# EAGLE schematic Device_Measurement_V1.3 (EAGLE 6.5.0)
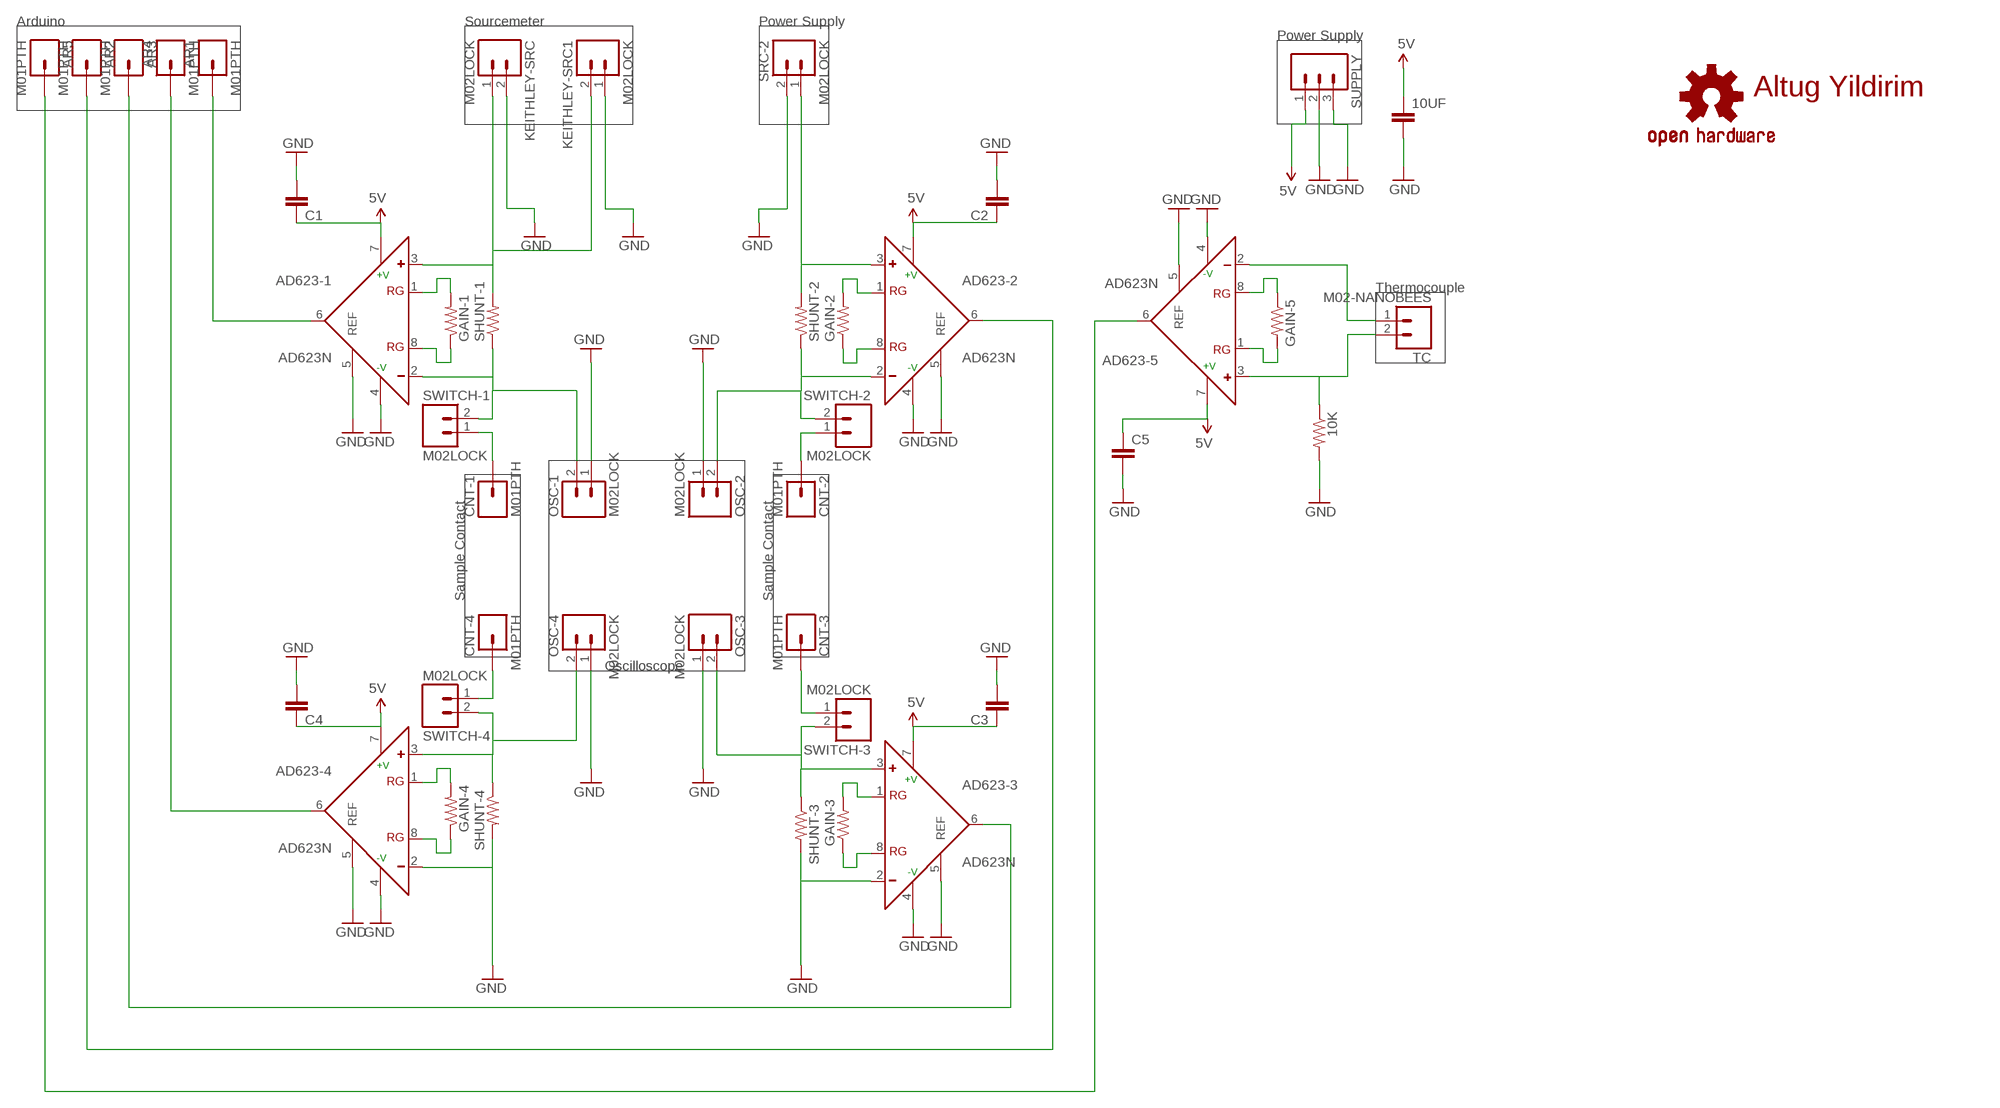
[diagram p0: schematic, sheet 1]

## Parts
10K  R-US_0207/10  [0207/10]
10UF  CAPPTH1  [CAP-PTH-5MM]
AD623-1  AD623N  [DIL08]
AD623-2  AD623N  [DIL08]
AD623-3  AD623N  [DIL08]
AD623-4  AD623N  [DIL08]
AD623-5  AD623N  [DIL08]
AR1  M01PTH  [1X01]
AR2  M01PTH  [1X01]
AR3  M01PTH  [1X01]
AR4  M01PTH  [1X01]
AR5  M01PTH  [1X01]
C1  CAPPTH1  [CAP-PTH-5MM]
C2  CAPPTH1  [CAP-PTH-5MM]
C3  CAPPTH1  [CAP-PTH-5MM]
C4  CAPPTH1  [CAP-PTH-5MM]
C5  CAPPTH1  [CAP-PTH-5MM]
CNT-1  M01PTH  [1X01]
CNT-2  M01PTH  [1X01]
CNT-3  M01PTH  [1X01]
CNT-4  M01PTH  [1X01]
GAIN-1  R-US_0207/10  [0207/10]
GAIN-2  R-US_0207/10  [0207/10]
GAIN-3  R-US_0207/10  [0207/10]
GAIN-4  R-US_0207/10  [0207/10]
GAIN-5  R-US_0207/10  [0207/10]
KEITHLEY-SRC  M02LOCK  [1X02_LOCK]
KEITHLEY-SRC1  M02LOCK  [1X02_LOCK]
LOGO1  OSHW-LOGOM  [OSHW-LOGO-M]
OSC-1  M02LOCK  [1X02_LOCK]
OSC-2  M02LOCK  [1X02_LOCK]
OSC-3  M02LOCK  [1X02_LOCK]
OSC-4  M02LOCK  [1X02_LOCK]
SHUNT-1  RESISTOR1206  [1206]
SHUNT-2  RESISTOR1206  [1206]
SHUNT-3  RESISTOR1206  [1206]
SHUNT-4  RESISTOR1206  [1206]
SRC-2  M02LOCK  [1X02_LOCK]
SUPPLY  M03PTH  [1X03]
SWITCH-1  M02LOCK  [1X02_LOCK]
SWITCH-2  M02LOCK  [1X02_LOCK]
SWITCH-3  M02LOCK  [1X02_LOCK]
SWITCH-4  M02LOCK  [1X02_LOCK]
TC  M02-NANOBEES  [M02-NANOBEES]

## Nets
5V: 10UF.1 AD623-1.7(+V) AD623-2.7(+V) AD623-3.7(+V) AD623-4.7(+V) AD623-5.7(+V) C1.1 C2.1 C3.1 C4.1 C5.1 SUPPLY.1
GND: 10K.2 10UF.2 AD623-1.4(-V) AD623-1.5(REF) AD623-2.4(-V) AD623-2.5(REF) AD623-3.2(-) AD623-3.4(-V) AD623-3.5(REF) AD623-4.2(-) AD623-4.4(-V) AD623-4.5(REF) AD623-5.4(-V) AD623-5.5(REF) C1.2 C2.2 C3.2 C4.2 C5.2 KEITHLEY-SRC1.1 KEITHLEY-SRC.2 OSC-1.1 OSC-2.1 OSC-3.1 OSC-4.1 SHUNT-3.2 SHUNT-4.2 SRC-2.2 SUPPLY.2 SUPPLY.3
N$1: AD623-1.6(OUT) AR1.1
N$2: CNT-1.1 SWITCH-1.1
N$3: AD623-2.6(OUT) AR2.1
N$4: AD623-1.1(RG) GAIN-1.2
N$5: AD623-4.6(OUT) AR4.1
N$6: AD623-1.8(RG) GAIN-1.1
N$7: AD623-3.6(OUT) AR3.1
N$8: AD623-2.2(-) OSC-2.2 SHUNT-2.1 SWITCH-2.2
N$9: AD623-5.6(OUT) AR5.1
N$10: AD623-4.3(+) OSC-4.2 SHUNT-4.1 SWITCH-4.2
N$11: AD623-2.3(+) SHUNT-2.2 SRC-2.1
N$12: CNT-2.1 SWITCH-2.1
N$13: AD623-2.1(RG) GAIN-2.2
N$14: AD623-2.8(RG) GAIN-2.1
N$15: AD623-3.3(+) OSC-3.2 SHUNT-3.1 SWITCH-3.2
N$17: 10K.1 AD623-5.3(+) TC.2
N$18: CNT-4.1 SWITCH-4.1
N$19: CNT-3.1 SWITCH-3.1
N$20: AD623-3.1(RG) GAIN-3.2
N$21: AD623-3.8(RG) GAIN-3.1
N$22: AD623-4.1(RG) GAIN-4.2
N$23: AD623-4.8(RG) GAIN-4.1
N$24: AD623-5.2(-) TC.1
N$25: AD623-5.1(RG) GAIN-5.2
N$26: AD623-5.8(RG) GAIN-5.1
N$27: AD623-1.2(-) OSC-1.2 SHUNT-1.1 SWITCH-1.2
N$30: AD623-1.3(+) KEITHLEY-SRC1.2 KEITHLEY-SRC.1 SHUNT-1.2

## Notes on the sheet
- Arduino | Sourcemeter | Power Supply
- Power Supply
- Altug Yildirim
- Thermocouple
- Sample Contact | Sample Contact
- Oscilloscope

## Library data of the parts
10K GAIN-1-GAIN-5 = resistor:R-US_: RESISTOR, American symbol
10UF C1-C5 = SparkFun-Capacitors:CAP: Capacitor Standard 0603 ceramic capacitor, and 0.1" leaded capacitor.
AD623-1-AD623-5 = analog-devices:AD623: Single-Supply, Rail-to-Rail, Low Cost Instrumentation Amplifier Source: http://www.analog.com/static/imported-files/data_sheets/AD623.pdf; MF: ALTERA CORPORATION; MPN: AD623ANZ; OC_FARNELL: 9603700; OC_NEWARK: 59K4402
AR1-AR5 CNT-1-CNT-4 = SparkFun-Connectors:M01: Header 1 Standard 1-pin 0.1" header. Use with straight break away headers (SKU : PRT-00116), right angle break away headers (PRT-00553), swiss pins (PRT-00743), machine pins (PRT-00117), and female headers (PRT-00115).
KEITHLEY-SRC KEITHLEY-SRC1 OSC-1-OSC-4 SRC-2 SWITCH-1-SWITCH-4 = SparkFun-Connectors:M02: Standard 2-pin 0.1" header. Use with - straight break away headers ( PRT-00116) - right angle break away headers (PRT-00553) - swiss pins (PRT-00743) - machine pins (PRT-00117) - female headers (PRT-00115) Molex polarized connector foot print use with: PRT-08233 with associated crimp pins and housings. 2.54_SCREWTERM for use with PRT-10571. 3.5mm Screw Terminal footprints for PRT-08084 5mm Screw Terminal footprints for use with PRT-08432
LOGO1 = SparkFun-Aesthetics:OSHW-LOGO: Open Source Hardware Logo This logo indicates the piece of hardware it is found on incorporates a OSHW license and/or adheres to the definition of open source hardware found here: http://freedomdefined.org/OSHW
SHUNT-1-SHUNT-4 = SparkFun-Resistors:RESISTOR: Resistor Basic schematic elements and footprints for 0603, 1206, and PTH resistors.
SUPPLY = SparkFun-Connectors:M03: Header 3 Standard 3-pin 0.1" header. Use with straight break away headers (SKU : PRT-00116), right angle break away headers (PRT-00553), swiss pins (PRT-00743), machine pins (PRT-00117), and female headers (PRT-00115). Molex polarized connector foot print use with SKU : PRT-08232 with associated crimp pins and housings.
TC = SparkFun-Connectors:M02-NANOBEES